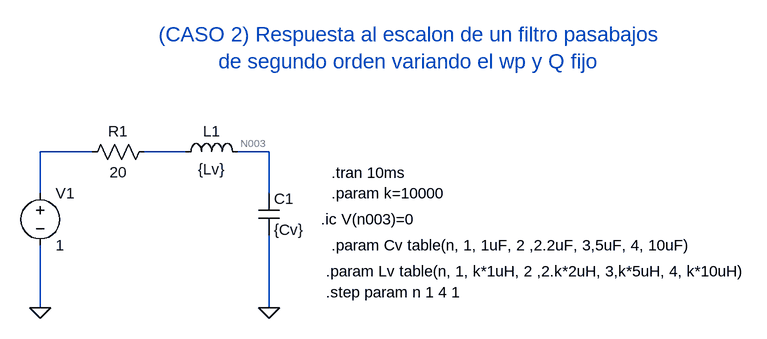
[diagram p0: schematic caso2_17_10.asc]
caso2_17_10.asc, the LTspice schematic file:
Version 4
SHEET 1 1252 680
WIRE 112 64 32 64
WIRE 256 64 192 64
WIRE 384 64 336 64
WIRE 32 128 32 64
WIRE 384 128 384 64
WIRE 32 304 32 208
WIRE 384 304 384 192
FLAG 384 304 0
FLAG 32 304 0
SYMBOL voltage 32 112 R0
SYMATTR InstName V1
SYMATTR Value 1
SYMBOL res 208 48 R90
WINDOW 0 0 56 VBottom 2
WINDOW 3 32 56 VTop 2
SYMATTR InstName R1
SYMATTR Value 20
SYMBOL ind 240 80 R270
WINDOW 0 32 56 VTop 2
WINDOW 3 5 56 VBottom 2
SYMATTR InstName L1
SYMATTR Value {Lv}
SYMBOL cap 368 128 R0
SYMATTR InstName C1
SYMATTR Value {Cv}
TEXT 480 96 Left 2 !.tran 10ms
TEXT 464 168 Left 2 !.ic V(n003)=0
TEXT 480 208 Left 2 !.param Cv table(n, 1, 1uF, 2 ,2.2uF, 3,5uF, 4, 10uF)
TEXT 480 128 Left 2 !.param k=10000
TEXT 472 248 Left 2 !.param Lv table(n, 1, k*1uH, 2 ,2.k*2uH, 3,k*5uH, 4, k*10uH)
TEXT 472 280 Left 2 !.step param n 1 4 1
TEXT 600 -96 Center 3 ;(CASO 2) Respuesta al escalon de un filtro pasabajos\nde segundo orden variando el wp y Q fijo

The netlist it stands for:
* caso2_17_10.asc
V1 N001 0 1
R1 N002 N001 20
L1 N002 N003 {Lv}
C1 N003 0 {Cv}
.tran 10ms
.ic V(n003)=0
.param Cv table(n, 1, 1uF, 2 ,2.2uF, 3,5uF, 4, 10uF)
.param k=10000
.param Lv table(n, 1, k*1uH, 2 ,2.k*2uH, 3,k*5uH, 4, k*10uH)
.step param n 1 4 1
* (CASO 2) Respuesta al escalon de un filtro pasabajos
* de segundo orden variando el wp y Q fijo
.backanno
.end